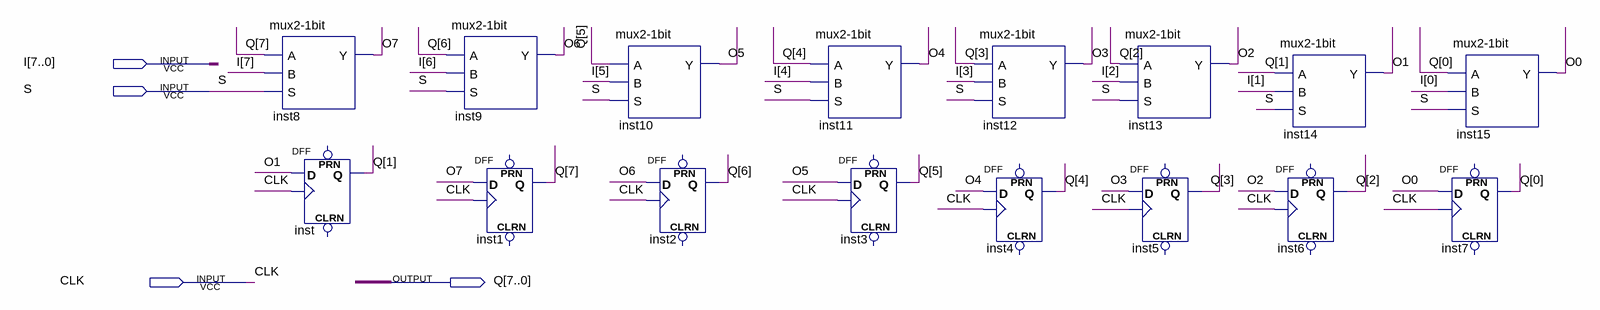
[diagram p0: schematic sheet]
// Quartus schematic RegProduct.bdf as structural Verilog: 16 symbols, 4 pins
module RegProduct (
  input  [7:0] I,
  input  S,
  input  CLK,
  output [7:0] Q
);

  wire O0, O1, O2, O3, O4, O5, O6, O7;

  \mux2-1bit  inst8 (.A(Q[7]), .B(I[7]), .S(S), .Y(O7));
  DFF inst (.CLK(CLK), .D(O1), .Q(Q[1]));  // open: CLRN, PRN
  \mux2-1bit  inst9 (.A(Q[6]), .B(I[6]), .S(S), .Y(O6));
  DFF inst1 (.CLK(CLK), .D(O7), .Q(Q[7]));  // open: CLRN, PRN
  \mux2-1bit  inst10 (.A(Q[5]), .B(I[5]), .S(S), .Y(O5));
  DFF inst2 (.CLK(CLK), .D(O6), .Q(Q[6]));  // open: CLRN, PRN
  \mux2-1bit  inst11 (.A(Q[4]), .B(I[4]), .S(S), .Y(O4));
  DFF inst3 (.CLK(CLK), .D(O5), .Q(Q[5]));  // open: CLRN, PRN
  \mux2-1bit  inst12 (.A(Q[3]), .B(I[3]), .S(S), .Y(O3));
  DFF inst4 (.CLK(CLK), .D(O4), .Q(Q[4]));  // open: CLRN, PRN
  \mux2-1bit  inst13 (.A(Q[2]), .B(I[2]), .S(S), .Y(O2));
  DFF inst5 (.CLK(CLK), .D(O3), .Q(Q[3]));  // open: CLRN, PRN
  \mux2-1bit  inst14 (.A(Q[1]), .B(I[1]), .S(S), .Y(O1));
  DFF inst6 (.CLK(CLK), .D(O2), .Q(Q[2]));  // open: CLRN, PRN
  \mux2-1bit  inst15 (.A(Q[0]), .B(I[0]), .S(S), .Y(O0));
  DFF inst7 (.CLK(CLK), .D(O0), .Q(Q[0]));  // open: CLRN, PRN
endmodule
